# Altium schematic sheet HVSG.SchDoc
size A4; SheetNumber: 1; SheetTotal: 1
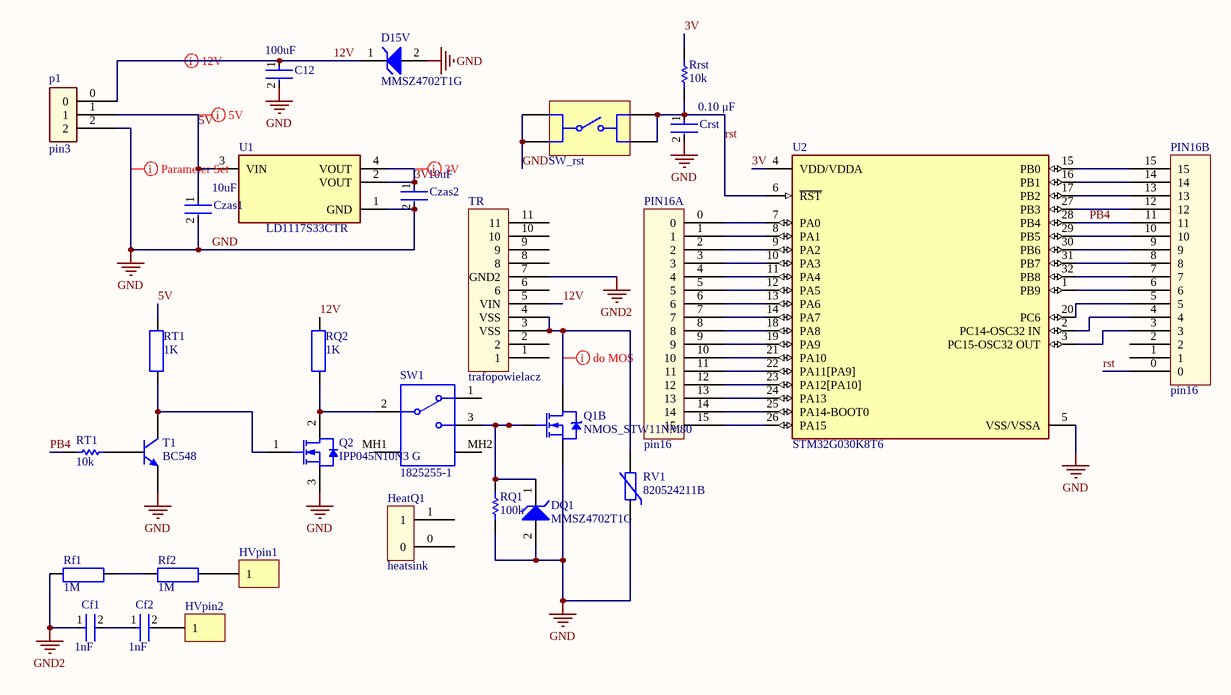
[diagram p0: HVSG.SchDoc]

## Parts
(Parts that share a designator on the sheet are numbered #1, #2 ... from top to bottom, then left to right.)
C12  Capacitance: 100uF  [FP-C1210C-FS-MFG]  (hidden comment: C1210C107M4PACTU)
Cf1  Capacitance: 1nF  [FP-ECKD4A102MDU-MFG]  (hidden comment: ECKD4A102MDU)
Cf2  Capacitance: 1nF  [FP-ECKD4A102MDU-MFG]  (hidden comment: ECKD4A102MDU)
Crst  value 0.10 μF  [FP-C0402-BB-MFG]  (hidden comment: C0402C104K8PACTU)
Czas1  Capacitance: 10uF  [FP-GRM188-0_1-e0_2_0_55-IPC_A]  (hidden comment: GRM188R60J106ME47D)
Czas2  Capacitance: 10uF  [FP-GRM188-0_1-e0_2_0_55-IPC_A]  (hidden comment: GRM188R60J106ME47D)
D15V  MMSZ4702T1G  [ONSC-SOD-123-2-425-04_V]
DQ1  MMSZ4702T1G  [ONSC-SOD-123-2-425-04_V]
HeatQ1  heatsink  [heatsink]  (mechanical)
HVpin1  GOLDPIN_1  [HDR1X1]  (value not drawn)
HVpin2  GOLDPIN_1  [HDR1X1]  (value not drawn)
p1  pin3  [pin3]
PIN16A  pin16  [pin16]
PIN16B  pin16  [pin16]
Q1  NMOS_STW11NM80  [NMOS_ STW11NM80]  (part B of 2)
Q2  IPP045N10N3 G  [INF-PG-TO220-3-1_A_V]
Rf1  value 1M  [AX_1/4W_4M]  (hidden comment: RES_AX_1/4W_4M)
Rf2  value 1M  [AX_1/4W_4M]  (hidden comment: RES_AX_1/4W_4M)
RQ1  100k  [RESC2013X60X35NL10T20]
RQ2  value 1K  [AX_1/4W_4M]  (hidden comment: RES_AX_1/4W_4M)
Rrst  10k  [RESC2013X60X35NL10T20]
RT1#1  value 1K  [AX_1/4W_4M]  (hidden comment: RES_AX_1/4W_4M)
RT1#2  10k  [RESC2013X60X35NL10T20]
RV1  820524211B  [D23W8.7H27P2.3]
SW1  1825255-1  [TECO-1825255-1_V]
SW_rst  SWITCH_SQ_6m_4X6m  [SQ_6m_4X6m]  (value not drawn)
T1  BC548  [TO-92W]
TR  trafopowielacz  [trafopowielacz]
U1  LD1117S33CTR  [FP-SOT-223-0046067_14-MFG]
U2  STM32G030K8T6  [FP-LQFP32-5V-IPC_A]

## Nets
GND: C12.2 Crst.2 Czas1.2 Czas2.2 D15V.2(A) DQ1.2(A) p1.2 Q1.3(S) Q2.3(SOURCE) RQ1.2 RV1.1 SW_rst.1 SW_rst.2 T1.3(E) U1.1(GND) U2.5(VSS/VSSA)
GND2: Cf1.1 Rf1.2 TR.7(GND2)
3V: Czas2.1 Rrst.2 U1.2(VOUT) U1.4(VOUT) U2.4(VDD/VDDA)
5V: Czas1.1 p1.1 RT1#1.2 U1.3(VIN)
12V: C12.1 D15V.1(K) p1.0 RQ2.2 TR.5(VIN)
PB4: PIN16B.11 RT1#2.2 U2.28(PB4)
rst: Crst.1 PIN16B.0 Rrst.1 SW_rst.3 SW_rst.4 U2.6(~{RST})
NetCf1_2: Cf1.2 Cf2.1
NetCf2_2: Cf2.2 HVpin2.1
NetDQ1_1: DQ1.1(K) Q1.1(G) RQ1.1 SW1.3
NetHVpin1_1: HVpin1.1 Rf2.1
NetPIN16A_0: PIN16A.0 U2.7(PA0)
NetPIN16A_1: PIN16A.1 U2.8(PA1)
NetPIN16A_2: PIN16A.2 U2.9(PA2)
NetPIN16A_3: PIN16A.3 U2.10(PA3)
NetPIN16A_4: PIN16A.4 U2.11(PA4)
NetPIN16A_5: PIN16A.5 U2.12(PA5)
NetPIN16A_6: PIN16A.6 U2.13(PA6)
NetPIN16A_7: PIN16A.7 U2.14(PA7)
NetPIN16A_8: PIN16A.8 U2.18(PA8)
NetPIN16A_9: PIN16A.9 U2.19(PA9)
NetPIN16A_10: PIN16A.10 U2.21(PA10)
NetPIN16A_11: PIN16A.11 U2.22(PA11[PA9])
NetPIN16A_12: PIN16A.12 U2.23(PA12[PA10])
NetPIN16A_13: PIN16A.13 U2.24(PA13)
NetPIN16A_14: PIN16A.14 U2.25(PA14-BOOT0)
NetPIN16A_15: PIN16A.15 U2.26(PA15)
NetPIN16B_3: PIN16B.3 U2.3(PC15-OSC32_OUT)
NetPIN16B_4: PIN16B.4 U2.2(PC14-OSC32_IN)
NetPIN16B_5: PIN16B.5 U2.20(PC6)
NetPIN16B_6: PIN16B.6 U2.1(PB9)
NetPIN16B_7: PIN16B.7 U2.32(PB8)
NetPIN16B_8: PIN16B.8 U2.31(PB7)
NetPIN16B_9: PIN16B.9 U2.30(PB6)
NetPIN16B_10: PIN16B.10 U2.29(PB5)
NetPIN16B_12: PIN16B.12 U2.27(PB3)
NetPIN16B_13: PIN16B.13 U2.17(PB2)
NetPIN16B_14: PIN16B.14 U2.16(PB1)
NetPIN16B_15: PIN16B.15 U2.15(PB0)
NetQ1_2: Q1.2(D) RV1.2 TR.3(VSS) TR.4(VSS)
NetQ2_1: Q2.1(GATE) RT1#1.1 T1.1(C)
NetQ2_2: Q2.2(DRAIN) RQ2.1 SW1.2
NetRf1_1: Rf1.1 Rf2.2
NetRT1#2_1: RT1#2.1 T1.2(B)

Not connected (* = marked no-connect by the designer): HeatQ1 0 1; PIN16B 1 2; SW1 1 MH1 MH2; TR 1 2 6 8 9 10 11

## Layout directives
rule Width Constraint [Pref Width = 1mm    Min Width = 0.254mm    Max Width = 1mm]: 5V
rule Width Constraint [Pref Width = 0.254mm    Min Width = 0.254mm    Max Width = 0.5mm]: 3V
rule Width Constraint [Pref Width = 0.254mm    Min Width = 0.254mm    Max Width = 2mm]: GND
rule Width Constraint [Pref Width = 0.254mm    Min Width = 0.254mm    Max Width = 1mm]: 12V, NetQ1_2

## Library data of the parts
C12 = CMP-03020-034653-1: CAP CER 100UF 16V X5R 1210; Tolerance: 20%; Dielectric Material: Ceramic; Max Operating Temperature: 85°C; REACH SVHC: No SVHC; Case Code (Metric): 3225; Case/Package: 1210; Thickness: 0.106inch; Length: 3.2mm; Min Operating Temperature: -55°C; Voltage Rating (DC): 16V; Weight: 0.000564oz; Packaging: Tape and Reel; Case Code (Imperial): 1210; Depth: 2.5mm; Lead Free: Lead Free; Width: 0.098inch; Voltage Rating: 16V; Termination: SMD/SMT; Dielectric: X5R; Package Quantity: 1000
Cf1 Cf2 = CMP-05432-000001-1: High Voltage Ceramic Disc Capacitors, Rated 4 to 15 kVDC, Temp. Char. Y5T, 1.0NF 10000V; Lead Length: 20mm; Insulation Resistance: 10GR; Tolerance: 20%; Voltage Rating: 10kV; Max Operating Temperature: 85°C; Dielectric Material: Ceramic; RoHS Compliant: Yes; Lead Pitch: 10mm; Case/Package: Radial; Dielectric: Y5T; Min Operating Temperature: -25°C; Reach SVHC Compliant: Yes
Crst = CMP-2008-02046-2: CAP CER 0.1UF 10V X5R 0402; Manufacturer: Kemet; Temperature Coefficient: 15%; Tolerance: 0.1; Material: Ceramic; Package: C0402-BB; Temperature: -55°C to +125°C; ComponentLink2Description: Datasheet; Capacitance: 0.10 μF; Temperature Characteristic: X5R; Device Class L1: Passive Components; Height: 0.55mm; Lead Free: Yes; ComponentLink2URL: https://content.kemet.com/datasheets/KEM_C1002_X7R_SMD.pdf; Device Class L2: Capacitors; Temperature Range Low: -55°C; Temperature Range High: +125°C; RoHS: TRUE; Octopart: https://octopart.com/c0402c104k8pactu-kemet-140039; Automotive: No; Mouser Description: Capacitor 100 nF 10 VDC 0402; Category: Cap; Voltage Rating: 10 V; Digikey Description: CAP CER 0.1UF 10V X5R 0402; Ipc Land Pattern Name: CAPC10050X50; Device Class L3: Ceramic Capacitors; Manufacturer Part Number: C0402C104K8PACTU
Czas1 Czas2 = CMP-2006-02792-2: Chip Multilayer Ceramic Capacitors for General Purpose, 0603, 10uF, X5R, 15%, 20%, 6.3V; Packaging: Tape and Reel; Voltage Rating (DC): 6.3V; Width: 0.031inch; Termination: SMD/SMT; Dielectric: X5R; Package Quantity: 4000; Voltage Rating: 6.3V; Case/Package: 0603; Min Operating Temperature: -55°C; Voltage: 6.3V; Length: 1.6mm; Thickness: 0.035inch; Lead Free: Lead Free; Depth: 0.8mm; Case Code (Imperial): 0603; Max Operating Temperature: 85°C; Material: Ceramic; Height: 0.8mm; Tolerance: 20%; Mount: Surface Mount; REACH SVHC: No SVHC; Radiation Hardening: No; Case Code (Metric): 1608
D15V DQ1 = CMP-1060-00296-1: Zener Voltage Regulator, 500 mW, 2-Pin SOD-123, Pb-Free, Tape and Reel; Manufacturer: On Semiconductor; VZ Typ (V): 15; P Max (W): 0.5; PackageVersion: Rev. G, 10/2009; ComponentLink3URL: http://www.onsemi.com/pub_link/Collateral/425-04.PDF; PackageReference: SOD-123-2-425-04; ComponentLink2URL: http://www.onsemi.com/pub_link/Collateral/MMSZ4678T1-D.PDF; PartNumber: MMSZ4702T1G; ComponentLink3Description: Package Specification; PackageDescription: 2-Pin SOD, Body 1.6 x 2.69 mm; ComponentLink1Description: Manufacturer URL; ComponentLink1URL: http://www.onsemi.com/; ComponentLink2Description: Datasheet; DatasheetVersion: Rev. 9; Packing: Tape and Reel; Mounting Technology: Surface Mount; RoHS: Pb-Free
HVpin1 HVpin2 = GOLDPIN_1: Header, 1-Pin; LatestRevisionDate: 17-Jul-2002; LatestRevisionNote: Re-released for DXP Platform.; Publisher: Altium Limited
Q2 = CMP-1091-00126-1: N-Channel OptiMOS 3 Power-Transistor, 100 V VDS, 100 A ID, -55 to 175 degC, PG-TO220-3-1, Tube, Green; Manufacturer: Infineon; VGS(th) (max): 3.5Â V; ID (max): 100Â A; QG: 88Â nC; Green: TRUE; Rth: 0.7Â K/W; Polarity: N; IDpuls (max): 400Â A; Ptot (max): 214Â W; VDS (max): 100Â V; RDS (on) (max): 4.5Â mOhm; RthJA (max): 62 K/W; VGS(th) (min): 2Â V; DatasheetVersion: Rev. 2.5; Packing: Tube; RthJC (max): 0.7Â K/W; Halogen-free: TRUE; ComponentLink1URL: http://www.infineon.com/; ComponentLink2Description: Datasheet; PackageDescription: 3-Pin Plastic (Green) Transistor Single Outline Package, 10.03 x 8.98 mm Body, 2.54 mm Pitch; PackageVersion: Rev. 05, 08/2007; Mounting Technology: Through Hole; ComponentLink3Description: Package Specification; ComponentLink1Description: Manufacturer URL; ComponentLink2URL: http://www.infineon.com/dgdl/IPP045N10N3+G_Rev2.5.pdf?folderId=db3a304313b8b5a60113cee8763b02d7&fileId=db3a30431ce5fb52011d1e8b0cc31586; PartNumber: IPP045N10N3 G; ComponentLink3URL: http://www.infineon.com/dgdl/IPP028N08N3_Rev1%5B1%5D.0.pdf?folderId=db3a304313b8b5a60113cee8763b02d7&fileId=db3a30432313ff5e0123a3c08e7326b5; PackageReference: PG-TO220-3-1
Rf1 Rf2 RQ2 RT1#1 = RES_AX_1/4W_4M: Resistor; Published: 8-Jun-2000; LatestRevisionDate: 17-Jul-2002; LatestRevisionNote: Re-released for DXP Platform.; PackageReference: AXIAL-0.4; Publisher: Altium Limited; PackageDescription: Axial Device, Thru-Hole; 2 Leads; 0.4 in Pin Spacing
RQ1 Rrst RT1#2 = CMP-1659-00013-4: Chip Resistor, 10 KOhm, +/- 1%, 0.125 W, -55 to 155 degC, 0805 (2012 Metric), RoHS, Tape and Reel; Manufacturer: Yageo; Voltage Rating: 150 V; Mount: Surface Mount; ComponentLink1Description: Manufacturer URL; ComponentLink2URL: http://www.yageo.com/documents/recent/PYu-RC_Group_51_RoHS_L_04.pdf; Pins: 2; Length: 2 mm; Min Operating Temperature: -55 degC; Height: 0.5 mm; Mounting Technology: Surface Mount; RoHSCompliant: true; REACH SVHC: No SVHC; ComponentLink1URL: http://www.yageo.com/; Max Operating Temperature: 155 degC; PackageReference: 0805; DatasheetVersion: Rev. 4, 02/2016; Package Quantity: 5000; Packaging: Tape and Reel; ComponentLink2Description: Datasheet; PackageDescription: 2-Pin Surface Mounted Device, Body 2 x 1.25 mm
RV1 = CMP-03913-22865219-1: 820524211B Disk Varistor Standard WE-VD - BULK; Varistor Voltage: 680V; Max Voltage Rating (AC): 420V; Clamping Current: 100A; Voltage Rating (DC): 560V; Energy: 344J; Capacitance: 570pF; Clamping Voltage: 1.12kV; Height: 25mm; Min Operating Temperature: -40°C; Voltage Rating (AC): 420V; REACH SVHC: Unknown; Lead Pitch: 10mm; Max Voltage Rating (DC): 560V; Thickness: 6mm; Max Operating Temperature: 85°C; NexarPartId: 22865219; Width: 6.2mm; RoHS: Compliant; Diameter: 23mm; Length: 23mm
SW1 = CMP-2100-03576-1: Slide Switch, SPDT, 125 V, -20 to 85 degC, 5-Pin THD, RoHS, Tray; Manufacturer: TE Connectivity; Electrical Life: 15000Cycles; Number of Positions: 2; Operating Force: 600gf; Max Voltage Rating (AC): 125V; Actuator Length: 4.5mm; Current Rating: 300mA; Contact Style: Shorting; Switch Travel: 4mm; Flammability Rating: UL94HB; Termination: PCPins; Package Quantity: 560; Throw Configuration: SPDT; Datasheet Version: Rev. A4, 03/2014; Mount: ThroughHole; Package Reference: 1825255-1; Case/Package: 300; Depth: 6.7mm; Packaging: Bulk; Package Description: 5-Pin Through Hole Device, Body 6.7 x 16 mm, Pitch 4 mm; REACH SVHC: Unknown; ELV: Compliant; Voltage Rating (AC): 125V; Max Current Rating: 300mA; Radiation Hardening: No; Min Operating Temperature: -20degC; Contact Plating: Silver; Length: 16mm; Manufacturer URL: http://www.te.com/; Orientation: Vertical; Contact Material: Copper; RoHSCompliant: true; Lead Free: LeadFree; Max Operating Temperature: 85degC; Datasheet URL: http://www.te.com/commerce/DocumentDelivery/DDEController?Action=showdoc&DocId=Customer+Drawing%7F1825255%7FA4%7Fpdf%7FEnglish%7FENG_CD_1825255_A4_baseFilename.pdf%7F1825255-1
SW_rst = SWITCH_SQ_6m_4X6m: Actuator Length: 1.5mm; Switch Function: Off-Mom; Voltage Rating: 12V; Current Rating: 50mA; Height: 4mm; Mount: Through Hole; Contact Current Rating: 50mA
T1 = BC548: Amplifier Transistor, NPN Silicon, 3-Pin TO-92, Bulk Box; Manufacturer: On Semiconductor; PartNumber: BC548B; IC Continuous (A): 0.1; fT Min (MHz): 150; Mounting Technology: Through Hole; ComponentLink3Description: Package Specification; Polarity: NPN; ComponentLink3URL: http://www.onsemi.cn/pub_link/Collateral/2N6426-D.PDF; ComponentLink2Description: Datasheet; ComponentLink1Description: Manufacturer URL; ComponentLink2URL: http://www.onsemi.com/pub_link/Collateral/BC546-D.PDF; PackageReference: TO-92-3-29-11_AM_SL; DatasheetVersion: Rev. 7; PackageDescription: 3-Pin Transistor Outline, Body 4.825 x 3.685 mm, Pitch 1.27 mm; PackageVersion: Rev. AM; Packing: Bulk Box; RoHS: FALSE; ComponentLink1URL: http://www.onsemi.com/
U1 = CMP-0244-00307-2: IC REG LINEAR 3.3V 800MA SOT223; Input Bias Current: 5mA; Output Voltage Accuracy: 1%; Dropout Voltage: 1.1V; Power Dissipation: 12W; Polarity: Positive; Min Input Voltage: 5.3V; Quiescent Current: 10mA; Max Output Current: 1.3A; Output Current: 950mA; Number of Regulators: 1; Max Supply Voltage: 15V; Output Type: Fixed; Output Voltage: 3.3V; Number of Terminals: 4; Min Supply Voltage: 3.3V; Termination: SMD/SMT; Mount: Surface Mount; Max Power Dissipation: 12W; Case/Package: SOT-223; Lead Free: Lead Free; Height: 1.8mm; REACH SVHC: No SVHC; Radiation Hardening: No; Width: 3.5mm; Length: 6.5mm; Packaging: Tape and Reel; Max Input Voltage: 15V; Accuracy: 1%; Weight: 0.01lb; Contact Plating: Tin; Max Operating Temperature: 125°C; Number of Pins: 4; Max Output Voltage: 3.3V; Min Operating Temperature: -40°C; Nominal Output Voltage: 3.3V; Package Quantity: 1; Min Output Voltage: 3.3V; Number of Outputs: 1
U2 = CMP-12105-000136-1: IC MCU 32BIT 64KB FLASH 32LQFP; RoHS Compliant: Yes